# Altium schematic sheet ArchitectureBlockDiagram.SchDoc
size A4; SheetNumber: 6; SheetTotal: 6
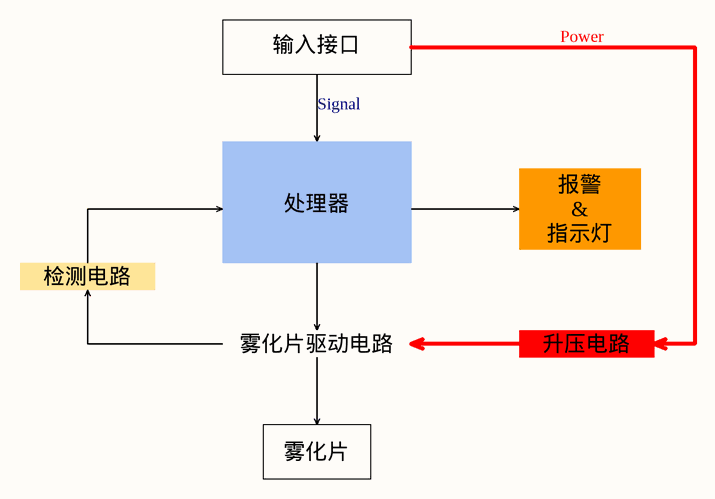
[diagram p0: ArchitectureBlockDiagram.SchDoc]

## Notes on the sheet
- 输入接口
- Power
- Signal
- 检测电路
- 处理器
- 报警
  &
  指示灯
- 雾化片驱动电路
- 升压电路
- 雾化片